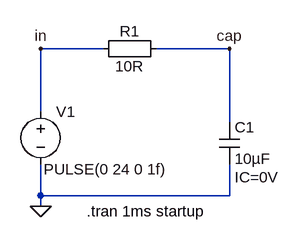
[diagram p0: schematic ltc001_RC.asc]
ltc001_RC.asc, the LTspice schematic file:
Version 4
SHEET 1 880 680
WIRE 112 0 16 0
WIRE 304 0 192 0
WIRE 16 96 16 0
WIRE 304 112 304 0
WIRE 16 224 16 176
WIRE 304 224 304 176
WIRE 304 224 16 224
WIRE 16 240 16 224
FLAG 16 240 0
FLAG 304 0 cap
FLAG 16 0 in
SYMBOL voltage 16 80 R0
WINDOW 3 5 104 Left 2
WINDOW 123 0 0 Left 2
WINDOW 39 0 0 Left 2
SYMATTR InstName V1
SYMATTR Value PULSE(0 24 0 1f)
SYMBOL cap 288 112 R0
WINDOW 40 24 84 Left 2
SYMATTR InstName C1
SYMATTR Value 10µF
SYMATTR SpiceLine2 IC=0V
SYMBOL Misc\\EuropeanResistor 208 -16 R90
WINDOW 0 5 56 VBottom 2
WINDOW 3 27 56 VTop 2
SYMATTR InstName R1
SYMATTR Value 10R
TEXT 86 248 Left 2 !.tran 1ms startup

The netlist it stands for:
* ltc001_RC.asc
V1 in 0 PULSE(0 24 0 1f)
C1 cap 0 10µF IC=0V
R1 cap in 10R
.tran 1ms startup
.backanno
.end